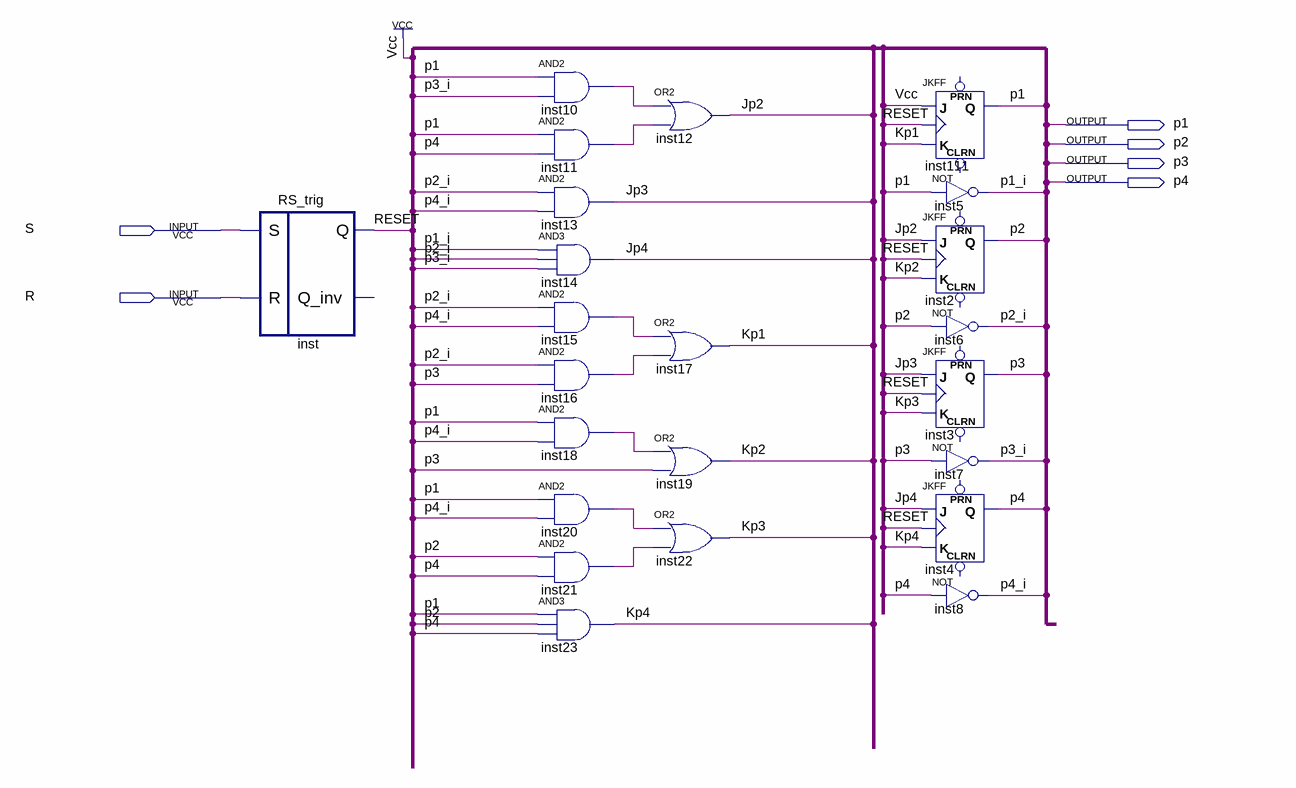
[diagram p0: schematic sheet]
// Quartus schematic lab_8_4.bdf as structural Verilog: 23 symbols, 6 pins
module lab_8_4 (
  input  S,
  input  R,
  output p1,
  output p2,
  output p3,
  output p4
);

  wire inst10_out, inst11_out, inst15_out, inst16_out, inst18_out, inst20_out, inst21_out, Jp2, Jp3, Jp4,
       Kp1, Kp2, Kp3, Kp4, p1_i, p2_i, p3_i, p4_i, RESET;

  RS_trig inst (.R(R), .S(S), .Q(RESET));  // open: Q_inv
  and inst10 (inst10_out, p1, p3_i);
  and inst11 (inst11_out, p1, p4);
  and inst13 (Jp3, p2_i, p4_i);
  and inst14 (Jp4, p1_i, p2_i, p3_i);
  and inst15 (inst15_out, p2_i, p4_i);
  and inst16 (inst16_out, p2_i, p3);
  and inst18 (inst18_out, p1, p4_i);
  and inst20 (inst20_out, p1, p4_i);
  and inst21 (inst21_out, p2, p4);
  and inst23 (Kp4, p1, p2, p4);
  or inst12 (Jp2, inst10_out, inst11_out);
  or inst17 (Kp1, inst15_out, inst16_out);
  or inst19 (Kp2, inst18_out, p3);
  or inst22 (Kp3, inst20_out, inst21_out);
  JKFF inst111 (.K(Kp1), .J(1'b1), .CLK(RESET), .Q(p1));  // open: PRN, CLRN
  not inst5 (p1_i, p1);
  JKFF inst2 (.K(Kp2), .J(Jp2), .CLK(RESET), .Q(p2));  // open: PRN, CLRN
  not inst6 (p2_i, p2);
  JKFF inst3 (.K(Kp3), .J(Jp3), .CLK(RESET), .Q(p3));  // open: PRN, CLRN
  not inst7 (p3_i, p3);
  JKFF inst4 (.K(Kp4), .J(Jp4), .CLK(RESET), .Q(p4));  // open: PRN, CLRN
  not inst8 (p4_i, p4);
endmodule
